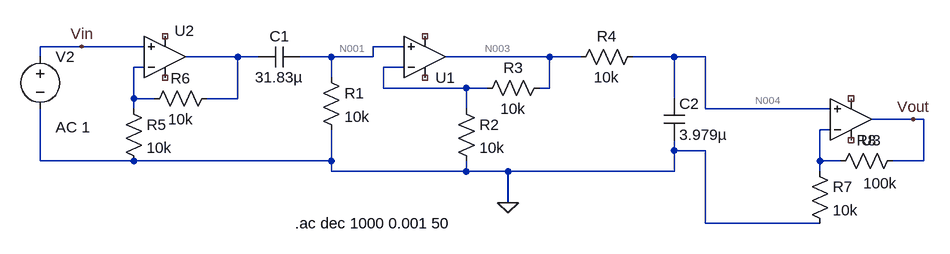
[diagram p0: schematic Draft3.asc]
Draft3.asc, the LTspice schematic file:
Version 4
SHEET 1 1180 680
WIRE -768 48 -832 48
WIRE -672 48 -768 48
WIRE -272 48 -320 48
WIRE -832 64 -832 48
WIRE -528 64 -608 64
WIRE -496 64 -528 64
WIRE -384 64 -432 64
WIRE -320 64 -320 48
WIRE -320 64 -384 64
WIRE -48 64 -208 64
WIRE 0 64 -48 64
WIRE 144 64 80 64
WIRE 192 64 144 64
WIRE -672 80 -688 80
WIRE -272 80 -304 80
WIRE -384 96 -384 64
WIRE -304 112 -304 80
WIRE -176 112 -304 112
WIRE -144 112 -176 112
WIRE -48 112 -48 64
WIRE -48 112 -64 112
WIRE -688 128 -688 80
WIRE -656 128 -688 128
WIRE -528 128 -528 64
WIRE -528 128 -576 128
WIRE 144 128 144 64
WIRE -688 144 -688 128
WIRE -176 144 -176 112
WIRE 192 144 192 64
WIRE 384 144 192 144
WIRE 512 160 448 160
WIRE 528 160 512 160
WIRE 384 176 368 176
WIRE 144 208 144 192
WIRE 192 208 144 208
WIRE -832 224 -832 144
WIRE -688 224 -832 224
WIRE -384 224 -384 176
WIRE -384 224 -688 224
WIRE 368 224 368 176
WIRE 400 224 368 224
WIRE 528 224 528 160
WIRE 528 224 480 224
WIRE -384 240 -384 224
WIRE -176 240 -176 224
WIRE -176 240 -384 240
WIRE -112 240 -176 240
WIRE 144 240 144 208
WIRE 144 240 -112 240
WIRE 368 240 368 224
WIRE -112 288 -112 240
WIRE 192 320 192 208
WIRE 368 320 192 320
FLAG -768 48 Vin
FLAG 512 160 Vout
FLAG -112 288 0
SYMBOL cap -432 48 R90
WINDOW 0 0 32 VBottom 2
WINDOW 3 32 32 VTop 2
SYMATTR InstName C1
SYMATTR Value 31.83µ
SYMBOL res -400 80 R0
SYMATTR InstName R1
SYMATTR Value 10k
SYMBOL res -192 128 R0
SYMATTR InstName R2
SYMATTR Value 10k
SYMBOL res -48 96 R90
WINDOW 0 0 56 VBottom 2
WINDOW 3 32 56 VTop 2
SYMATTR InstName R3
SYMATTR Value 10k
SYMBOL res 96 48 R90
WINDOW 0 0 56 VBottom 2
WINDOW 3 32 56 VTop 2
SYMATTR InstName R4
SYMATTR Value 10k
SYMBOL cap 128 128 R0
SYMATTR InstName C2
SYMATTR Value 3.979µ
SYMBOL OpAmps\\UniversalOpAmp -240 64 M180
SYMATTR InstName U1
SYMBOL voltage -832 48 R0
WINDOW 123 24 124 Left 2
WINDOW 39 0 0 Left 0
SYMATTR Value2 AC 1
SYMATTR InstName V2
SYMATTR Value ""
SYMBOL OpAmps\\UniversalOpAmp -640 64 M180
WINDOW 0 15 40 Left 2
SYMATTR InstName U2
SYMBOL res -704 128 R0
SYMATTR InstName R5
SYMATTR Value 10k
SYMBOL res -560 112 R90
WINDOW 0 0 56 VBottom 2
WINDOW 3 32 56 VTop 2
SYMATTR InstName R6
SYMATTR Value 10k
SYMBOL OpAmps\\UniversalOpAmp 416 160 M180
SYMATTR InstName U3
SYMBOL res 352 224 R0
SYMATTR InstName R7
SYMATTR Value 10k
SYMBOL res 496 208 R90
WINDOW 0 0 56 VBottom 2
WINDOW 3 35 35 VTop 2
SYMATTR InstName R8
SYMATTR Value 100k
TEXT -440 320 Left 2 !.ac dec 1000 0.001 50

The netlist it stands for:
* Draft3.asc
C1 N001 N002 31.83µ
R1 N001 0 10k
R2 N006 0 10k
R3 N003 N006 10k
R4 N004 N003 10k
C2 N004 0 3.979µ
XU1 N001 N006 NC_01 NC_02 N003 level1 Avol=1Meg GBW=10Meg Vos=0 En=0 Enk=0 In=0 Ink=0 Rin=500Meg  ; pins In+ In- V+ V- OUT
V2 Vin 0 AC 1
XU2 Vin N005 NC_03 NC_04 N002 level1 Avol=1Meg GBW=10Meg Vos=0 En=0 Enk=0 In=0 Ink=0 Rin=500Meg  ; pins In+ In- V+ V- OUT
R5 N005 0 10k
R6 N002 N005 10k
XU3 N004 N007 NC_05 NC_06 Vout level1 Avol=1Meg GBW=10Meg Vos=0 En=0 Enk=0 In=0 Ink=0 Rin=500Meg  ; pins In+ In- V+ V- OUT
R7 N007 0 10k
R8 Vout N007 100k
.ac dec 1000 0.001 50
.lib UniversalOpAmp1.lib
.backanno
.end

* Results of the author's LTspice run, read from the files saved beside the schematic
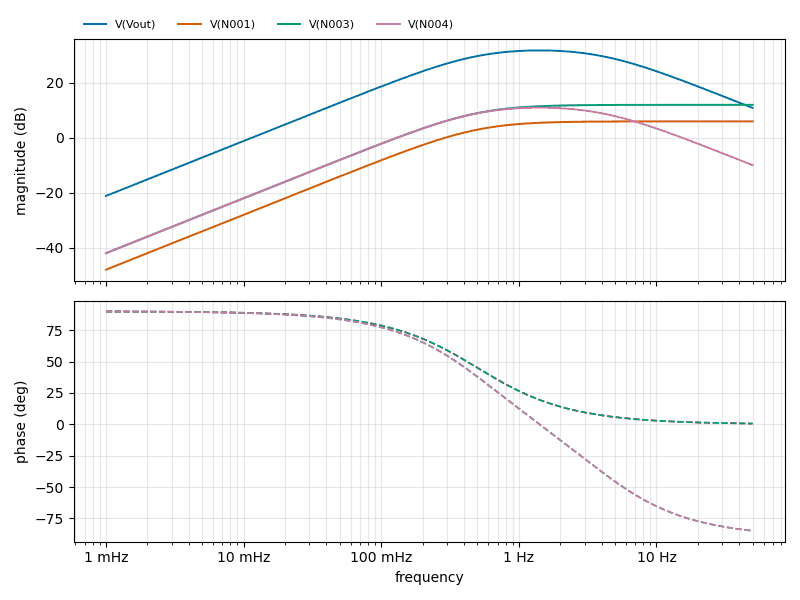
[diagram p1: AC Analysis of Draft3.asc, plotted from the saved traces]
* AC Analysis, 1 run:
*   V(Vout): -21.11 dB at 1 mHz, 10.90 dB at 50 Hz, peak 31.85 dB at 1.416 Hz, 3 dB below the peak at 407.5 mHz and 4.907 Hz
*   V(N001): -47.96 dB at 1 mHz, 6.02 dB at 50 Hz, peak 6.02 dB at 50 Hz, 3 dB below the peak at 500 mHz
*   V(N003): -41.94 dB at 1 mHz, 12.04 dB at 50 Hz, peak 12.04 dB at 50 Hz, 3 dB below the peak at 500 mHz
*   V(N004): -41.94 dB at 1 mHz, -9.93 dB at 50 Hz, peak 11.02 dB at 1.416 Hz, 3 dB below the peak at 407.5 mHz and 4.907 Hz